# EAGLE schematic Bus Definition V1.1 (EAGLE 7.6.0)
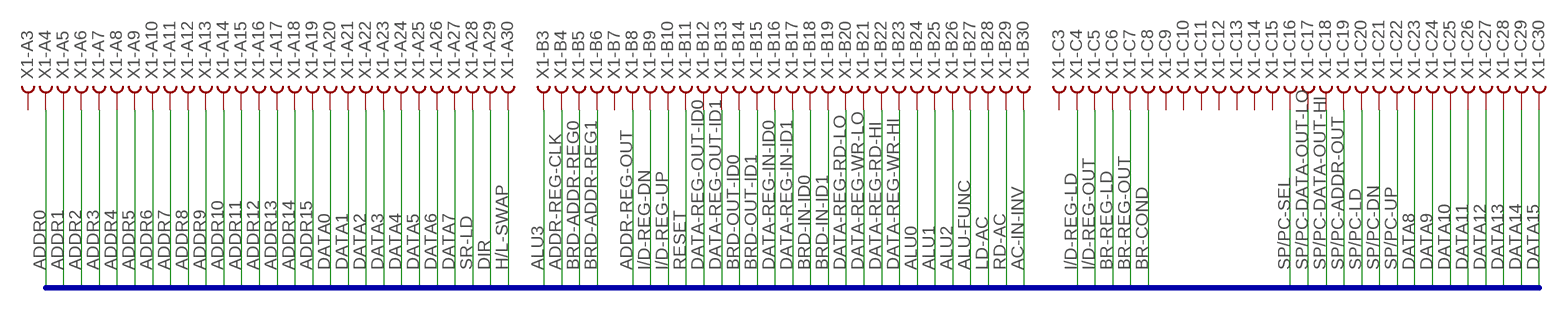
[diagram p0: schematic, sheet 1]

## Parts
X1  FABC96R  [FABC96R]

## Nets
AC-IN-INV: X1.B30
ADDR0: X1.A4
ADDR1: X1.A5
ADDR2: X1.A6
ADDR3: X1.A7
ADDR4: X1.A8
ADDR5: X1.A9
ADDR6: X1.A10
ADDR7: X1.A11
ADDR8: X1.A12
ADDR9: X1.A13
ADDR10: X1.A14
ADDR11: X1.A15
ADDR12: X1.A16
ADDR13: X1.A17
ADDR14: X1.A18
ADDR15: X1.A19
ADDR-REG-CLK: X1.B4
ADDR-REG-OUT: X1.B8
ALU0: X1.B24
ALU1: X1.B25
ALU2: X1.B26
ALU3: X1.B3
ALU-FUNC: X1.B27
BR-COND: X1.C8
BR-REG-LD: X1.C6
BR-REG-OUT: X1.C7
BRD-ADDR-REG0: X1.B5
BRD-ADDR-REG1: X1.B6
BRD-IN-ID0: X1.B18
BRD-IN-ID1: X1.B19
BRD-OUT-ID0: X1.B14
BRD-OUT-ID1: X1.B15
DATA0: X1.A20
DATA1: X1.A21
DATA2: X1.A22
DATA3: X1.A23
DATA4: X1.A24
DATA5: X1.A25
DATA6: X1.A26
DATA7: X1.A27
DATA8: X1.C23
DATA9: X1.C24
DATA10: X1.C25
DATA11: X1.C26
DATA12: X1.C27
DATA13: X1.C28
DATA14: X1.C29
DATA15: X1.C30
DATA-REG-IN-ID0: X1.B16
DATA-REG-IN-ID1: X1.B17
DATA-REG-OUT-ID0: X1.B12
DATA-REG-OUT-ID1: X1.B13
DATA-REG-RD-HI: X1.B22
DATA-REG-RD-LO: X1.B20
DATA-REG-WR-HI: X1.B23
DATA-REG-WR-LO: X1.B21
DIR: X1.A29
H/L-SWAP: X1.A30
I/D-REG-DN: X1.B9
I/D-REG-LD: X1.C4
I/D-REG-OUT: X1.C5
I/D-REG-UP: X1.B10
LD-AC: X1.B28
RD-AC: X1.B29
RESET: X1.B11
SP/PC-ADDR-OUT: X1.C19
SP/PC-DATA-OUT-HI: X1.C18
SP/PC-DATA-OUT-LO: X1.C17
SP/PC-DN: X1.C21
SP/PC-LD: X1.C20
SP/PC-SEL: X1.C16
SP/PC-UP: X1.C22
SR-LD: X1.A28
Unconnected: X1.A1 X1.A2 X1.A3 X1.A31 X1.A32 X1.B1 X1.B2 X1.B7 X1.B31 X1.B32 X1.C1 X1.C2 X1.C3 X1.C9 X1.C10 X1.C11 X1.C12 X1.C13 X1.C14 X1.C15 X1.C31 X1.C32

## Buses
ADDR[0..15],DATA[0..15],DIR,H/L-SWAP,ADDR-REG-CLK,BRD-ADDR-REG[0..1],ADDR-REG-OUT,I/D-REG-DN,I/D-REG-UP,RESET,DATA-REG-OUT-ID[0..1],BRD-OUT-ID[0..1],DATA-REG-IN-ID[0..1],BRD-IN-ID[0..1],DATA-REG-RD-LO,DATA-REG-WR-LO,DATA-REG-RD-HI,DATA-REG-WR-HI,ALU[0..3],ALU-FUNC,LD-AC,RD-AC,AC-IN-INV,I/D-REG-LD,I/D-REG-OUT,BR-REG-LD,BR-REG-OUT,BR-COND,SP/PC-SEL,SP/PC-DATA-OUT-LO,SP/PC-DATA-OUT-HI,SP/PC-ADDR-OUT,SP/PC-LD,SP/PC-DN,SP/PC-UP,SR-LD

## Library data of the parts
X1 = con-vg:FABC96R: CONNECTOR female, 96 pins, type R, rows ABC, grid 2.54 mm